# Altium schematic sheet plp_com_h4.SchDoc: VISUR-R
size 420 x 297 mm; Address1: Address1; Address2: Address2; Address3: Address3; Address4: Address4; DocumentNumber: АБВГ.123456.001 Э3; SheetNumber: 1; Scale: 1:1; DocumentType: Схема электрическая принципиальная; FirstReferrence: АБВГ.123456.001
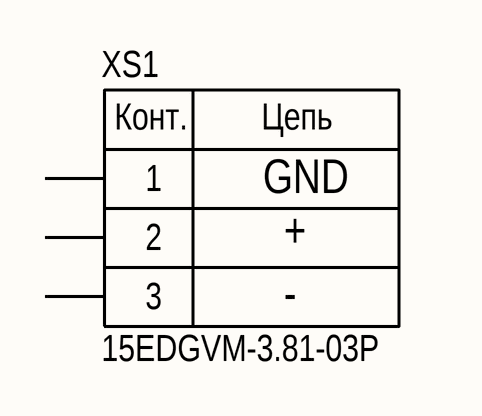
[diagram p0: plp_com_h4.SchDoc]

## Parts
XS1  15EDGVM-3.81-03P  [CON: 15EDGVM-3.81-03P]

## Nets

Not connected (* = marked no-connect by the designer): XS1 1 2 3

## Notes on the sheet
- GND
- +
- -
- Перв. примен.
- Справ. №
- Подп. и дата
- Инв. № дубл.
- Взам. инв. №
- Разраб.
- Изм.
- Лист
- № докум.
- Подп.
- Дата
- Лит.
- Масса
- Масштаб
- Пров.
- Т.контр.
- Листов
- Инв. № подл.
- Утв.
- Н.контр.
- 2.106-A3
- Копировал
- Формат А3
- (in symbol 15EDGVM-3.81-03P) Конт.; Цепь